# EAGLE design akabeacon_square_da14580_small (EAGLE 7.2.0)
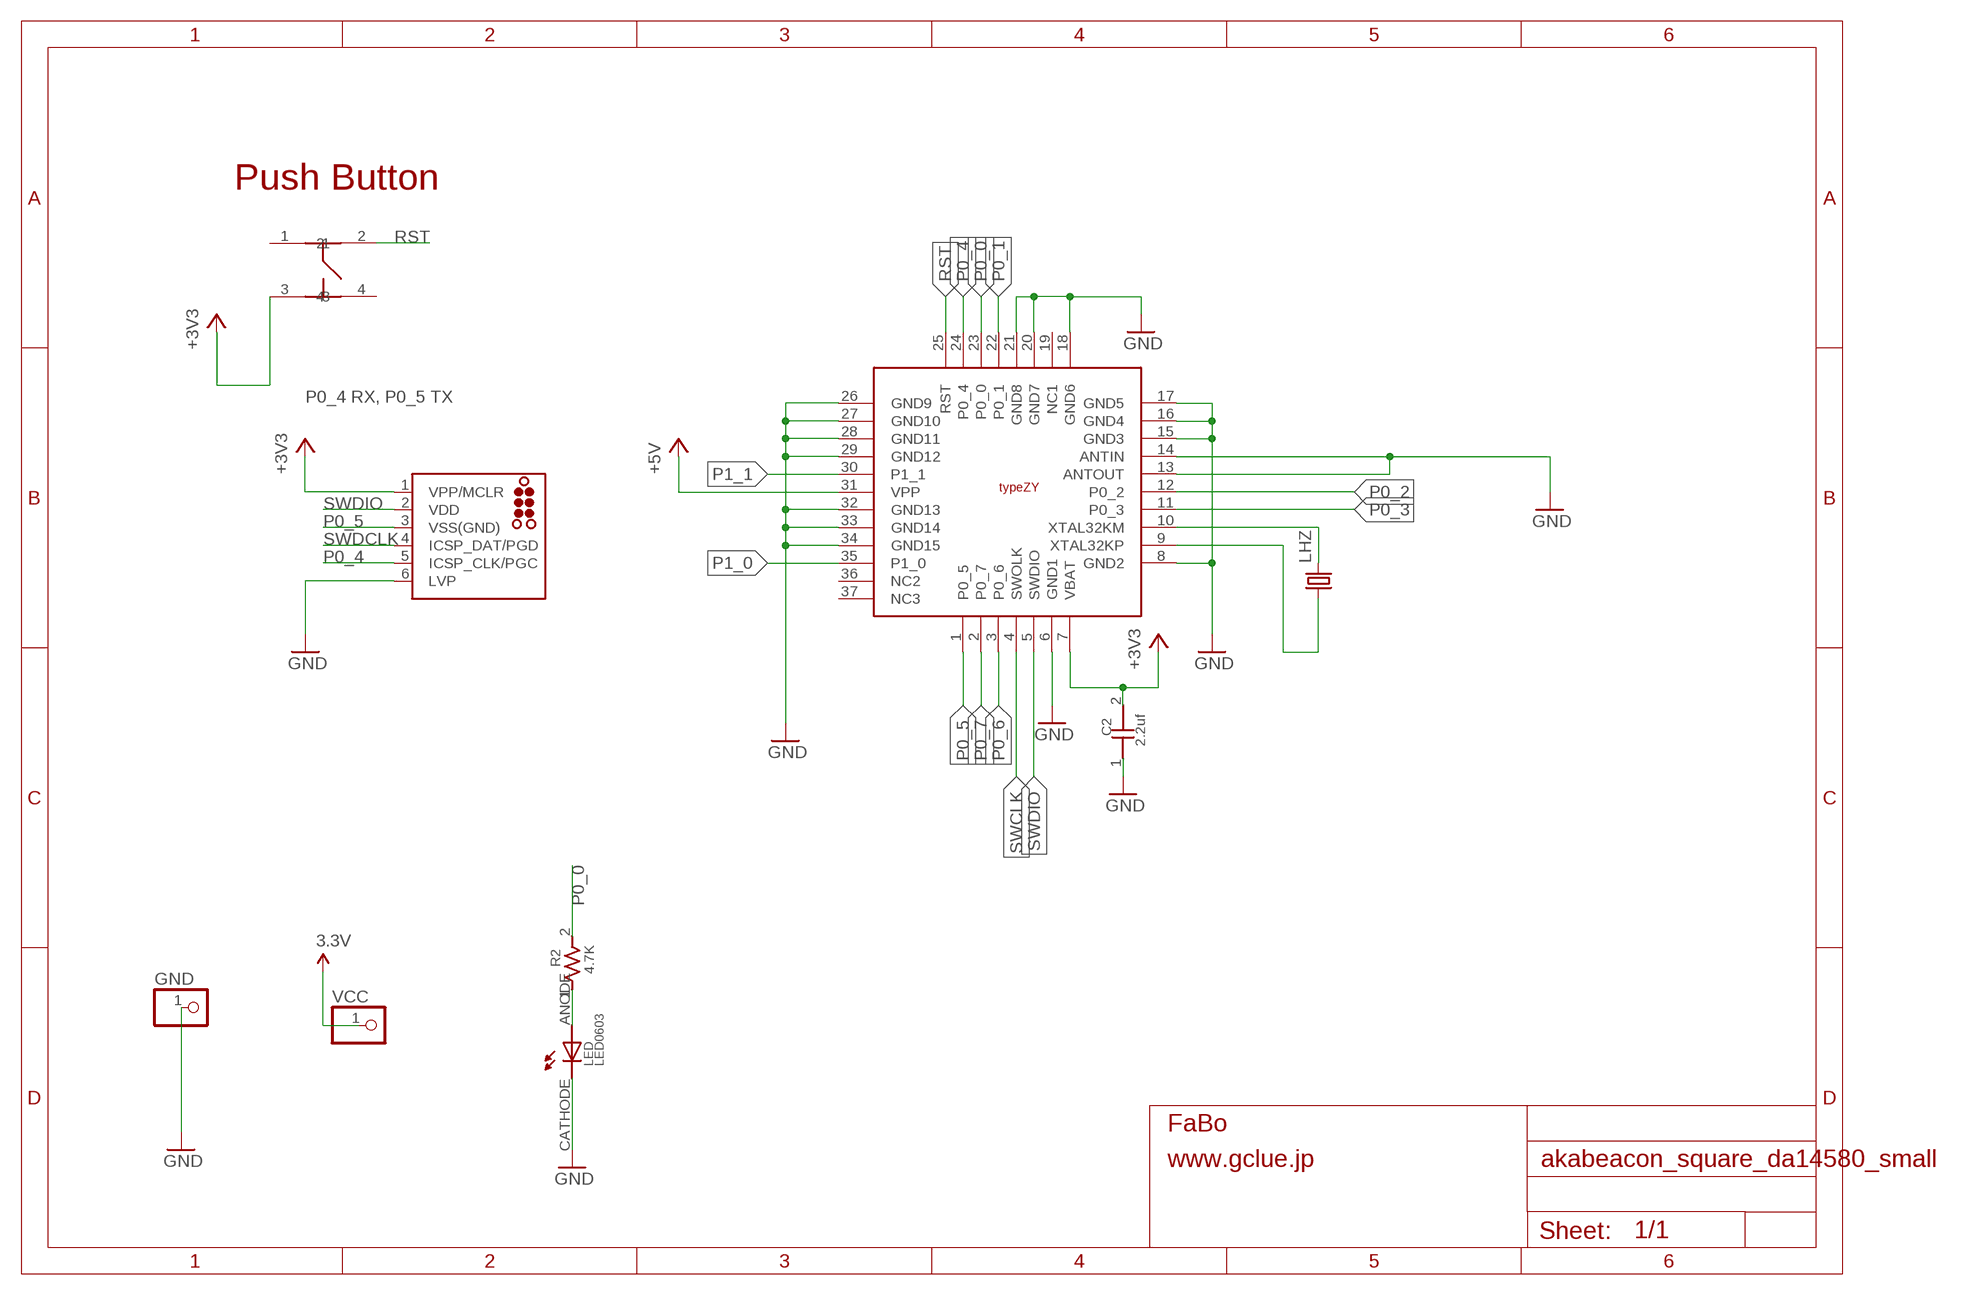
[diagram p0: schematic, sheet 1]

## Parts
C2  2.2uf  CAPACITOR0603  [0603]
GND  PINHD-1X1CB  [1X01-CLEANBIG]
J2  TC2030-MCP  [TC2030-MCP]
LED  LED0603  [0603]
LHZ  FC-12M  [FC-12M]
R2  4.7K  RESISTOR0603  [0603]
U$7  SWICTH-4P(KMR2)  [SWITCH-4P(KMR2)]
U$9  MURATA-TYPEZY  [MURATA_TYPEZY]
VCC  PINHD-1X1CB  [1X01-CLEANBIG]

## Nets
3.3V: VCC.1
+3V3: C2.2 J2.1(VPP/MCLR) U$7.3 U$9.7(VBAT)
+5V: U$9.31(VPP)
GND: C2.1 GND.1 J2.6(LVP) LED.CATHODE U$9.6(GND1) U$9.8(GND2) U$9.13(ANTOUT) U$9.14(ANTIN) U$9.15(GND3) U$9.16(GND4) U$9.17(GND5) U$9.18(GND6) U$9.20(GND7) U$9.21(GND8) U$9.26(GND9) U$9.27(GND10) U$9.28(GND11) U$9.29(GND12) U$9.32(GND13) U$9.33(GND14) U$9.34(GND15)
N$2: LED.ANODE R2.1
P0_0: R2.2 U$9.23(P0_0)
P0_1: U$9.22(P0_1)
P0_2: U$9.12(P0_2)
P0_3: U$9.11(P0_3)
P0_4: J2.5(ICSP_CLK/PGC) U$9.24(P0_4)
P0_5: J2.3(VSS(GND)) U$9.1(P0_5)
P0_6: U$9.3(P0_6)
P0_7: U$9.2(P0_7)
P1_0: U$9.35(P1_0)
P1_1: U$9.30(P1_1)
RST: U$7.2 U$9.25(RST)
SWCLK: U$9.4(SWOLK)
SWDCLK: J2.4(ICSP_DAT/PGD)
SWDIO: J2.2(VDD) U$9.5(SWDIO)
XTAL32KM: LHZ.2 U$9.10(XTAL32KM)
XTAL32KP: LHZ.1 U$9.9(XTAL32KP)
Unconnected: U$7.1 U$7.4 U$9.19(NC1) U$9.36(NC2) U$9.37(NC3)

## Notes on the sheet
- Push Button
- P0_4 RX, P0_5 TX

## Library data of the parts
C2 = GClue-Capacitor:CAPACITOR
GND VCC = adafruit:PINHD-1X1: Pin header 1x1 for 0.1" spacing With round pins
J2 = tag-connect:TC2030: TAG-CONNECT ICSP Connector Manufacturer: Tag-Connect <http://www.tag-connect.com> Cable for easy In-Circuit Serial Programming. Designed for Microchip ICD2, suitable for many others. Two variants - one "with legs" (for hands-free fit on PCB) and another "without legs" for quick programming. PAD Description 1 MCLR/Vpp 2 Vdd 3 GND 4 PGD (ISPDAT) 5 PGC (ISPCLK) 6 nc (used for LVP) ©2009 ROFA.cz - modified and updated by Robert Darlington ‹rdarlington@gmail.com›
LED = GClue-LED:LED
LHZ = crystal:FC-12M: kHz RANGE CRYSTAL UNIT LOW PROFILE SMD Source: Epson Toyocom FC-12M.pdf
R2 = GClue-Resistors:RESISTOR
U$7 = gclue-test:SWICTH-4P(KMR2)
U$9 = GClueBT:MURATA-TYPEZY

## Board
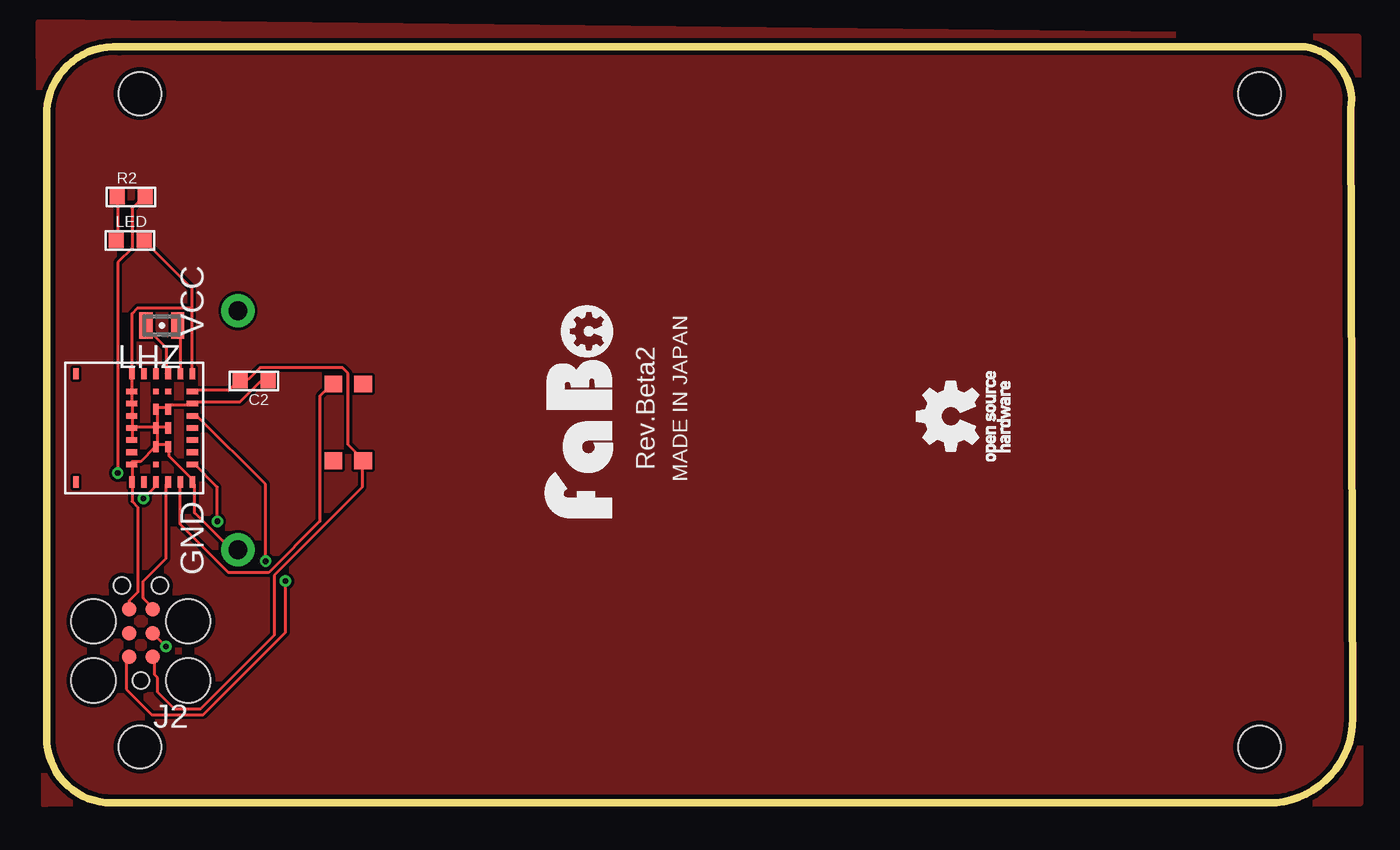
[diagram p1: board, top side]
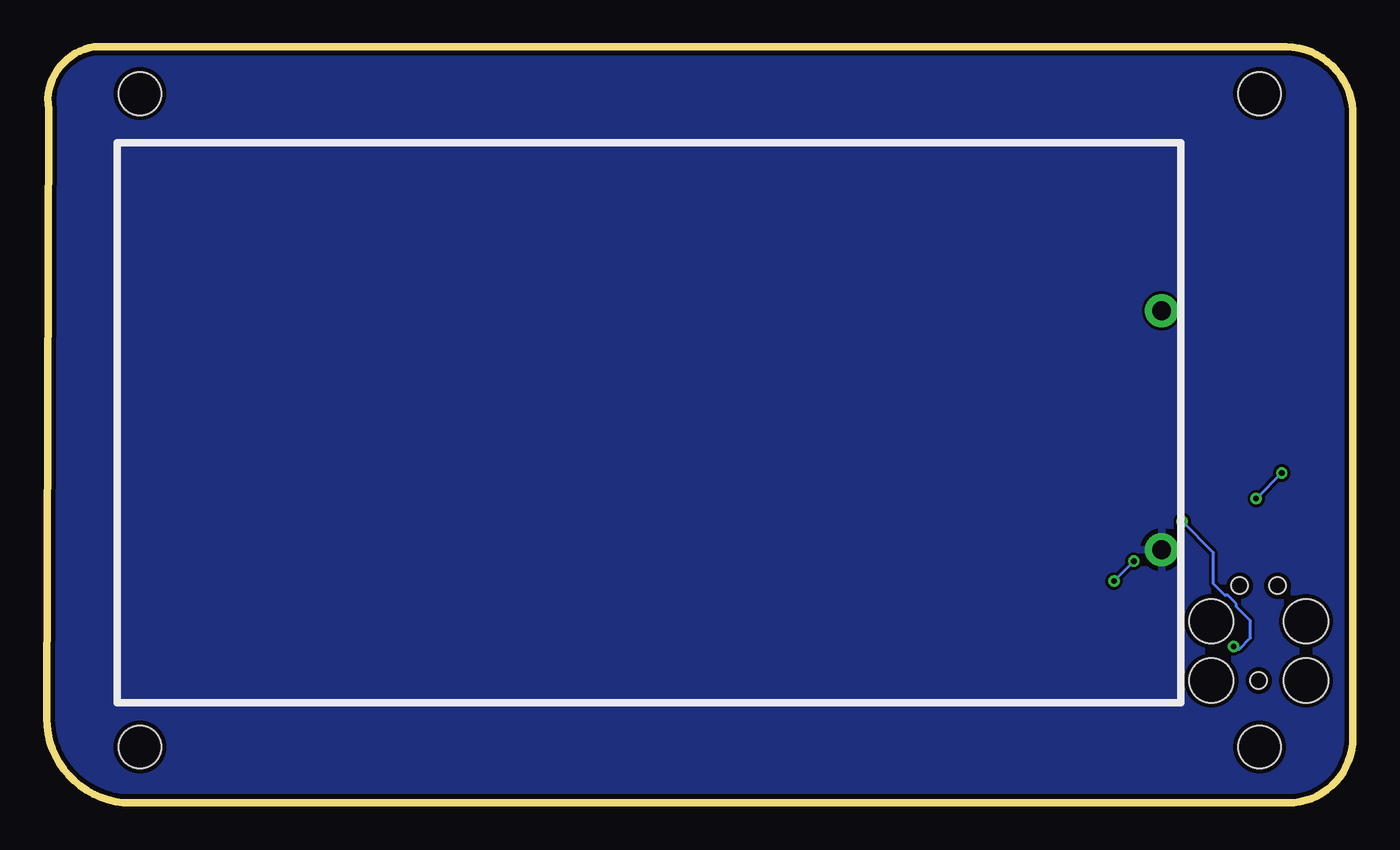
[diagram p2: board, bottom side, seen from below]

Size 70 x 40.52 mm. Coordinates in mm from the lower left corner, seen from the top.
Outline: 0,37.1 0,3.49 arc90 3.49,0 65.47,0 arc90 70,4.53 69.9,37.18 arc90 67.44,40.51 3.89,40.51 arc90 0,37.1
Copper layers (1*16): Top 0.035mm / dielectric 1.5mm / Bottom 0.035mm
Design rules "SeeedStudio_2layer_DRU_no_angle_20140221": minimum track width 6mil, minimum drill 12mil, track to track 6mil, track to pad 6mil, pad to pad 6mil, via to via 6mil, smd to smd 0mil, copper to edge 10mil, drill to drill 10mil, minimum pad ring 10mil, minimum via ring 6mil, stop-mask expansion 2mil, vias tented up to drill 100mil, thermal gap 10mil
Holes 2.3 mm at 5,3 5,38 65,38 65,3

### Footprints (pad centres in the part's own frame; a part is rotated, then mirrored left to right if it is on the bottom)
0603 = smd 0.8 x 0.8: 1 -0.75,0; 2 0.75,0
1X01-CLEANBIG = drill 1.016 pad 1.778: 1 0,0
TC2030-MCP = smd 0.787 x 0.787: 1 1.27,-0.635; 2 1.27,0.635; 3 2.54,-0.635; 4 2.54,0.635; 5 3.81,-0.635; 6 3.81,0.635 | hole 0.889: 0,0; 5.08,-1.016; 5.08,1.016 | hole 2.375: 0,2.54; 0,-2.54; 3.175,-2.54; 3.175,2.54
0603' = smd 0.8 x 0.8: ANODE -0.75,0; CATHODE 0.75,0
FC-12M = smd 0.7 x 1.4: 1 -0.85,0; 2 0.85,0
SWITCH-4P(KMR2) = smd 0.9 x 0.95: 1 -1,0; 2 3.1,0; 3 -1,-1.6; 4 3.1,-1.6
MURATA_TYPEZY = smd 0.3 x 0.6: 1 -1.95,-1.625; 2 -1.3,-1.625; 3 -0.65,-1.625; 4 0,-1.625; 5 0.65,-1.625; 6 1.3,-1.625; 7 1.95,-1.625; 14 1.95,1.625; 15 1.3,1.625; 16 0.65,1.625; 17 0,1.625; 18 -0.65,1.625; 19 -1.3,1.625; 20 -1.95,1.625 | smd 0.6 x 0.3: 8 2.9,-1.625; 9 2.9,-0.975; 10 2.9,-0.325; 11 2.9,0.325; 12 2.9,0.975; 13 2.9,1.625; 21 -2.9,1.625; 22 -2.9,0.975; 23 -2.9,0.325; 24 -2.9,-0.325; 25 -2.9,-0.975; 26 -2.9,-1.625; 27 -1,-0.325; 28 0,-0.325; 29 1,-0.325; 32 1,0.325; 33 0,0.325; 34 -1,0.325; 36 2.9,4.625; 37 -2.9,4.625 | smd 0.3 x 0.3: 30 1.95,-0.325; 31 1.95,0.325; 35 -1.95,0.325

### Placement (x,y rotation side)
C2  11.11,22.61 180 top
GND  10.25,13.57 90 top
J2  5.05,6.56 90 top
LED  LED0603  [0603']  4.47,30.14 0 top
LHZ  6.17,25.58 180 top
R2  4.53,32.47 0 top
U$2  [LOGO_FABO_M]  30.35,20.97 90 top
U$4  [LOGO_OSHW_T_M]  48.47,20.72 90 top
U$7  15.36,19.34 90 top
U$9  6.19,20.09 90 top
VCC  10.25,26.37 90 top

### Tracks (layer width: path | path; a pad name or v marks a point on that pad's centre or on a via)
+3V3
  Top 0.152: U$9.7 7.92,22.1 9.75,22.1 10.21,22.55 C2.2 10.36,22.71 10.82,22.71 11.43,23.32 15.85,23.32 16.15,23.01 16.15,19.2 16.92,18.44 U$7.3 16.92,18.29 16.92,16.92 12.19,12.19 12.19,8.99 8.23,5.03 6.86,5.03 5.94,5.94 5.94,6.71 5.79,6.86 5.79,7.77 J2.1
AGND
  pour Top: 0,0 70.36,0 70.27,41.02 -0.39,41.8 -0.1,-0.1
GND
  Top 0.152: 7.77,26.52 7.77,27.58 5.33,30.02 LED.CATHODE | 7.77,26.52 7.77,23.01 U$9.8 | J2.6 4.42,10.52 4.42,10.82 4.88,11.28 4.88,15.85 4.57,16.15 4.57,17.07 U$9.21 4.57,17.22 U$9.20 4.57,18.29 5.03,18.29 5.79,19.05 U$9.34 5.94,19.2 | C2.1 11.73,22.55 11.43,22.55 10.36,21.49 7.92,21.49 U$9.6 7.77,21.34 6.71,21.34 6.55,21.18 U$9.29 6.4,21.18 5.94,21.18 U$9.32 5.94,21.03 5.94,20.12 | U$9.18 4.57,19.51 4.57,19.96 U$9.17 4.57,20.12 | 4.57,20.12 4.57,20.73 U$9.16 4.57,20.88 4.57,21.34 U$9.15 4.57,21.49 4.57,21.95 U$9.14 4.57,22.1 4.57,22.86 U$9.13 4.57,23.01 4.57,26.21 4.88,26.52 7.77,26.52 | 5.94,20.12 6.4,20.12 U$9.28 | 5.94,19.2 6.4,19.2 U$9.27 6.55,19.05 6.55,18.59 7.77,17.37 7.77,17.22 U$9.26 7.92,17.07 7.92,15.54 9.75,13.72 10.21,13.72 GND.1 | 5.94,19.2 5.94,19.96 U$9.33 | 4.57,20.12 5.79,20.12 U$9.33 | 5.94,20.12 U$9.33
  pour Bottom: -0.1,-0.2 70.36,-0.2 70.17,41.79 -0.39,41.79 -0.2,-0.49
N$2
  Top 0.152: LED.ANODE 3.81,30.18 3.81,32.46 R2.1
P0_0  (via drill 0.3)
  Top 0.152: v5.18,16.31 5.79,16.92 5.79,17.07 U$9.23 | v3.81,17.68 3.81,28.96 4.57,29.72 4.57,31.85 5.18,32.46 R2.2
  Bottom 0.152: v3.81,17.68 v5.18,16.31
P0_4
  Top 0.152: U$9.24 6.4,17.07 6.4,13.11 5.18,11.89 5.18,10.97 5.64,10.52 J2.5
P0_5  (via drill 0.3)
  Top 0.152: v9.14,15.09 9.14,16.92 7.92,18.14 U$9.1 | v6.4,8.38 5.79,8.99 J2.3
  Bottom 0.152: v9.14,15.09 7.47,13.41 7.47,11.73 6.86,11.12 6.71,11.12 6.25,10.67 6.25,10.52 5.49,9.75 5.49,8.84 6.1,8.23 6.25,8.23 v6.4,8.38
RST
  Top 0.152: U$9.25 7.16,17.07 7.16,14.94 9.75,12.34 11.89,12.34 14.63,15.09 14.63,21.79 15.24,22.4 U$7.2
SWDIO  (via drill 0.3)
  Top 0.152: v11.73,12.95 11.73,17.07 8.08,20.73 7.92,20.73 U$9.5 | v12.8,11.89 12.8,9.14 8.38,4.72 5.64,4.72 4.27,6.1 4.27,7.77 J2.2
  Bottom 0.152: v12.8,11.89 v11.73,12.95
XTAL32KM
  Top 0.152: U$9.10 6.4,23.01 6.4,24.38 5.33,25.45 LHZ.2
XTAL32KP
  Top 0.152: U$9.9 7.16,23.01 7.16,25.45 LHZ.1

### Text on the board
tPlace: Rev.Beta2 | MADE IN JAPAN